# Altium schematic sheet XXXX.468323.001 Драйвер бесколлекторного мотора. Схема электрическая принципиальная.SchDoc
size 594 x 420 mm; SheetNumber: 1; SheetTotal: 1; Разраб.: Воробьев; Обозначение документа: XXXX.468323.001 Э3; Общее количество листов: 1; Наименование изделия 2: Схема электрическая; Наименование изделия 3: принципиальная
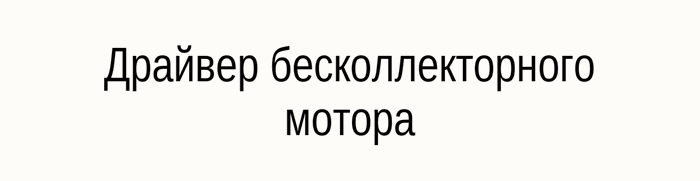
[diagram p0: XXXX.468323.001 Драйвер бесколлекторного мотора. Схема электрическая принципиальная.SchDoc]

## Notes on the sheet
- Драйвер бесколлекторного мотора
- Перв. примен.
- Справ. №
- Подп. и дата
- Инв. № дубл.
- Взам. инв. №
- Разраб.
- Изм.
- Лист
- № докум.
- Подп.
- Дата
- Лит.
- Масса
- Масштаб
- Пров.
- Т.контр.
- Листов
- Инв. № подл.
- Утв.
- Н.контр.
- Копировал
- Формат А2